# Altium schematic sheet 32原理图.SchDoc
size A2
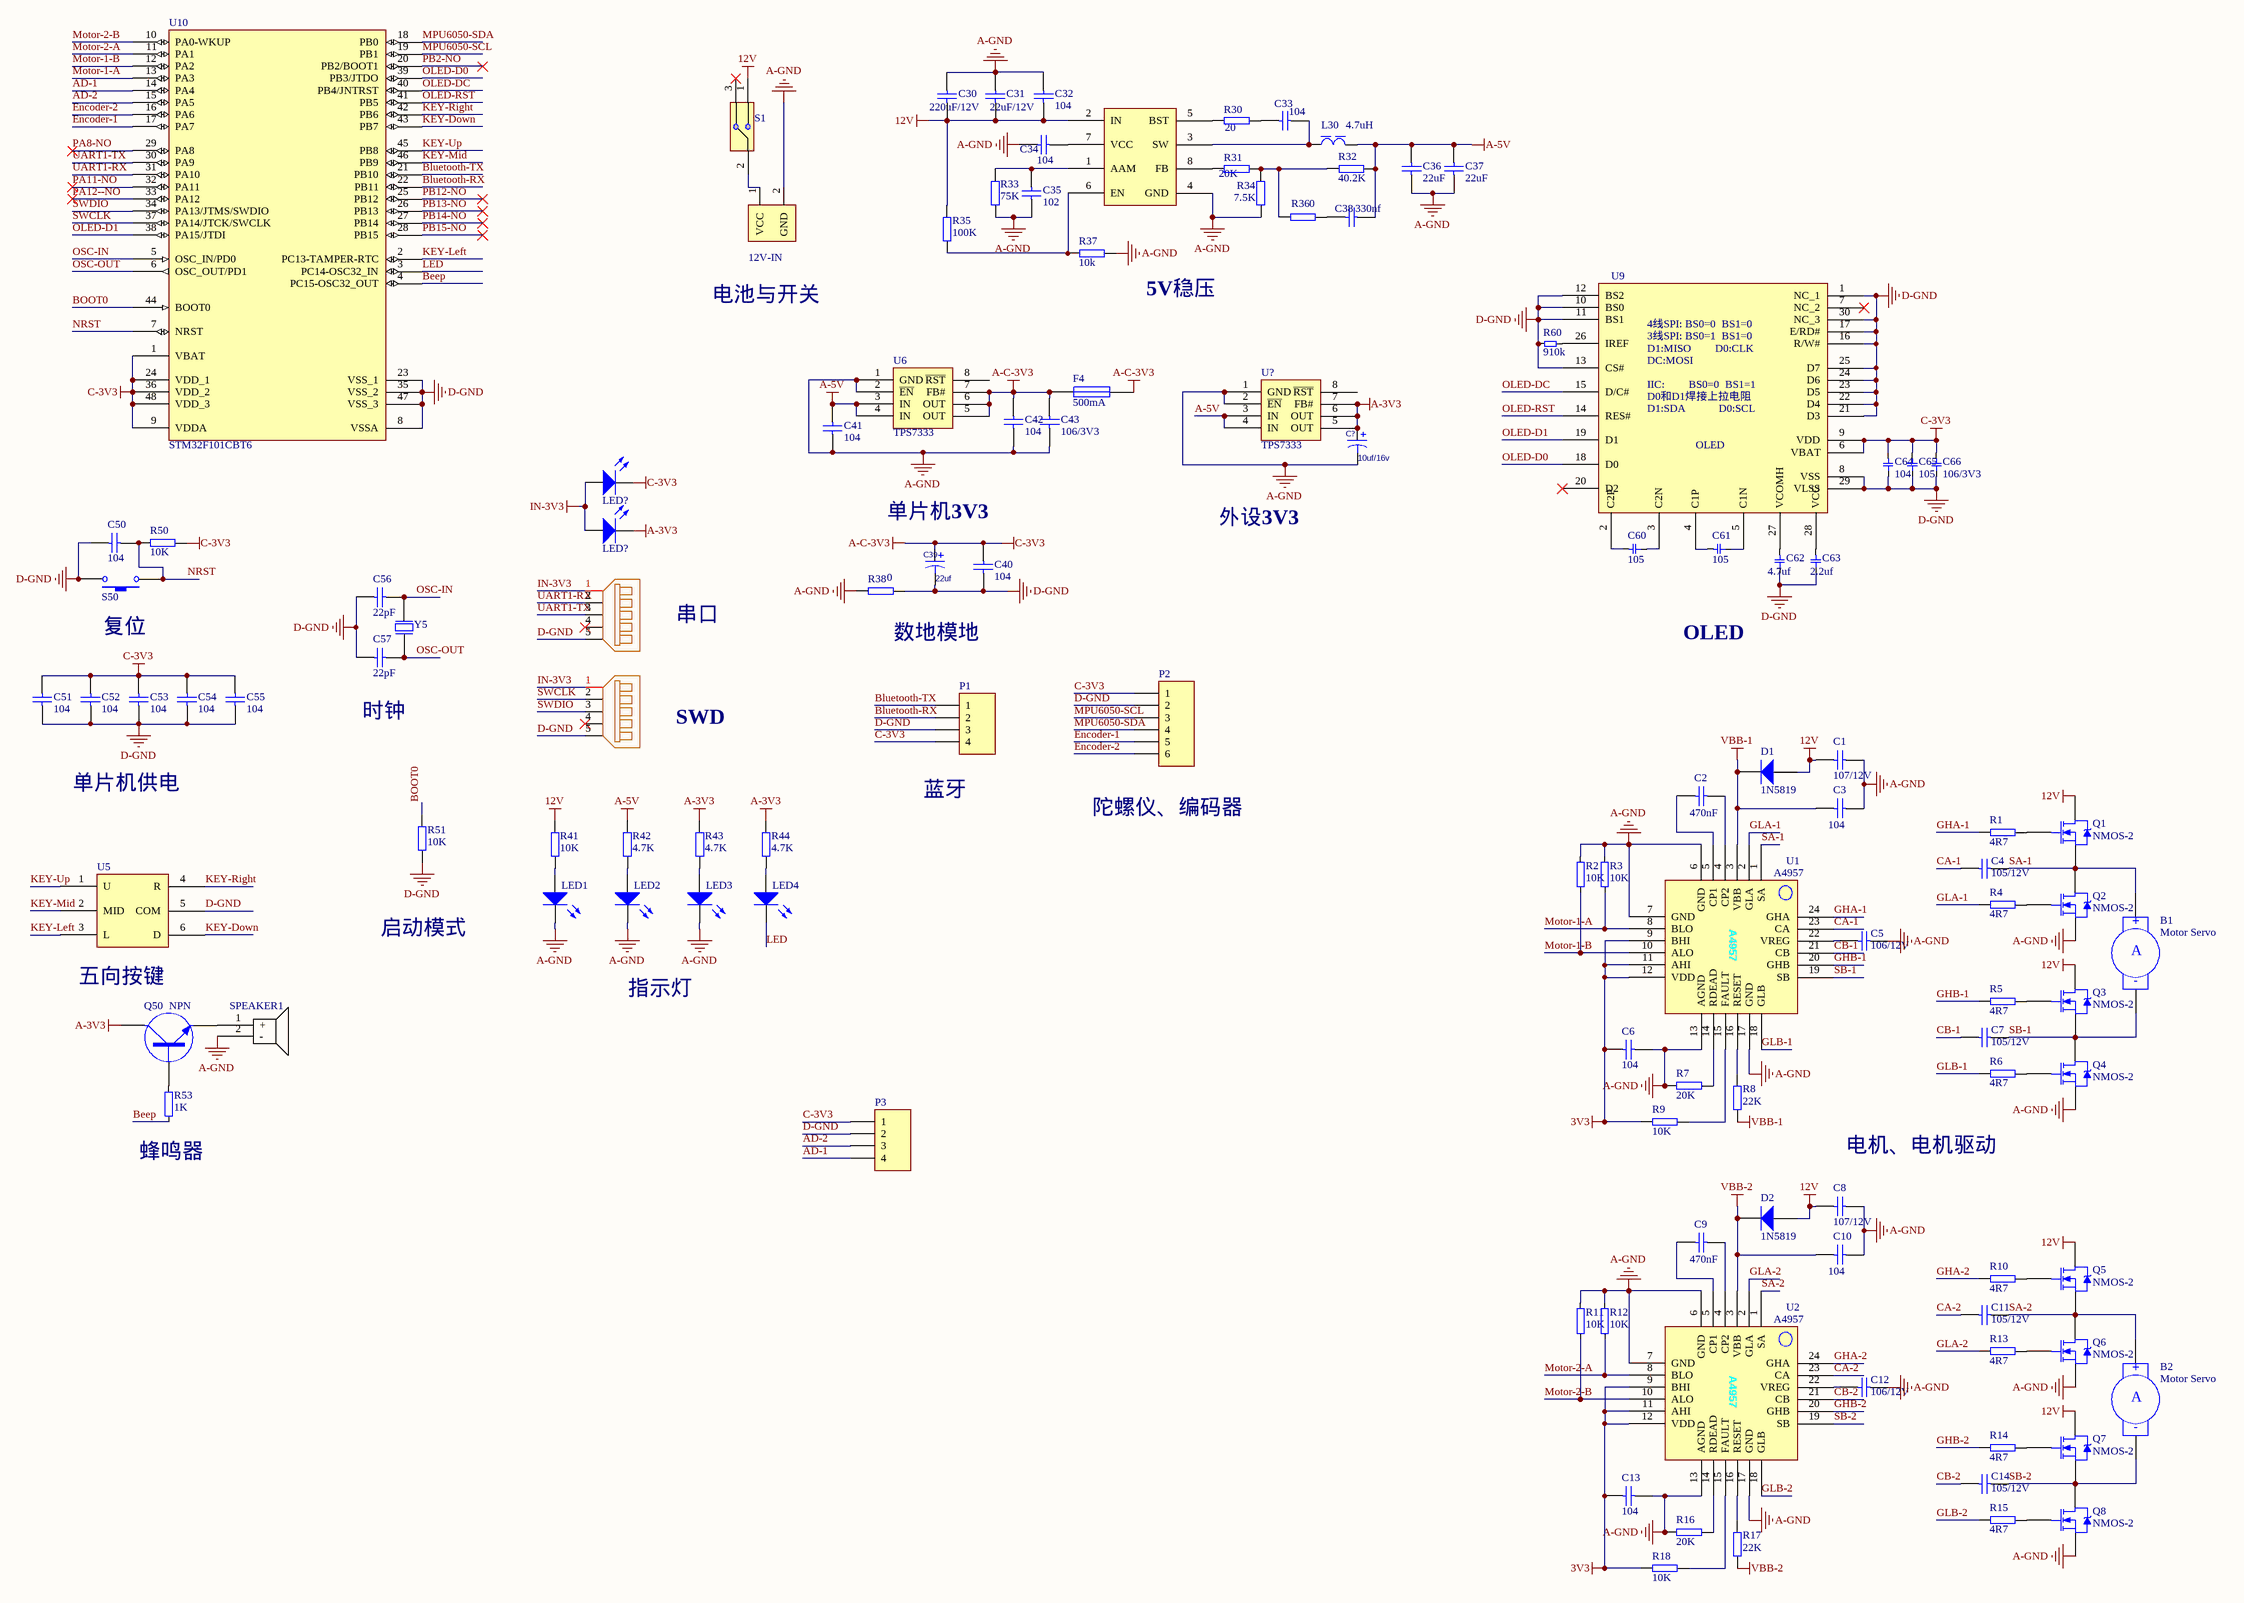
[diagram p0: 32原理图.SchDoc]

## Parts
(Parts that share a designator on the sheet are numbered #1, #2 ... from top to bottom, then left to right.)
12V-IN  Power12  [VBAT-2]  (value not drawn)
B1  Motor Servo  [电机接口 - duplicate]
B2  Motor Servo  [电机接口 - duplicate]
C1  107/12V  [CAPC4532[1812]]
C2  470nF  [CAPC1608[0603]]
C3  104  [CAPC1608[0603]]
C4  105/12V  [CAPC1608[0603]]
C5  106/12V  [CAPC2012[0805]]
C6  104  [CAPC1608[0603]]
C7  105/12V  [CAPC1608[0603]]
C8  107/12V  [CAPC4532[1812]]
C9  470nF  [CAPC1608[0603]]
C10  104  [CAPC1608[0603]]
C11  105/12V  [CAPC1608[0603]]
C12  106/12V  [CAPC2012[0805]]
C13  104  [CAPC1608[0603]]
C14  105/12V  [CAPC1608[0603]]
C30  220uF/12V  [CAPT7343]
C31  22uF/12V  [CAPC2012[0805]]
C32  104  [CAPC1608[0603]]
C33  104  [CAPC1608[0603]]
C34  104  [CAPC1608[0603]]
C35  102  [CAPC1608[0603]]
C36  22uF  [CAPC2012[0805]]
C37  22uF  [CAPC2012[0805]]
C38  330nf  [CAPC1608[0603]]
C39  value 22uf  [CAPT7343]  (hidden comment: Cap Pol2)
C40  104  [CAPC1608[0603]]
C41  104  [CAPC1608[0603]]
C42  104  [CAPC1608[0603]]
C43  106/3V3  [CAPC1608[0603]]
C50  104  [CAPC1608[0603]]
C51  104  [CAPC1608[0603]]
C52  104  [CAPC1608[0603]]
C53  104  [CAPC1608[0603]]
C54  104  [CAPC1608[0603]]
C55  104  [CAPC1608[0603]]
C56  22pF  [CAPC1608[0603]]
C57  22pF  [CAPC1608[0603]]
C60  105  [CAPC1608[0603]]
C61  105  [CAPC1608[0603]]
C62  4.7uf  [CAPC2012[0805]]
C63  2.2uf  [CAPC1608[0603]]
C64  104  [CAPC1608[0603]]
C65  105  [CAPC1608[0603]]
C66  106/3V3  [CAPC2012[0805]]
C?  value 10uf/16v  [钽电容3216]  (hidden comment: Cap Pol2)
D1  1N5819  [SMA[DO-214AC]]
D2  1N5819  [SMA[DO-214AC]]
F4  500mA  [CAPC2012[0805]]
L30  4.7uH  [CD52]
LED1  Red  [LED-0603]  (value not drawn)
LED2  Red  [LED-0603]  (value not drawn)
LED3  Red  [LED-0603]  (value not drawn)
LED4  Red  [LED-0603]  (value not drawn)
LED?#1  Red  [LED-0603]  (value not drawn)
LED?#2  Red  [LED-0603]  (value not drawn)
P1  蓝牙  [MK1.25_4P立]  (value not drawn)
P2  陀螺仪、编码器  [6P-卧头]  (value not drawn)
P3  蓝牙  [MK1.25_4P立]  (value not drawn)
Q1  NMOS-2  [IR7843-mg]
Q2  NMOS-2  [IR7843-mg]
Q3  NMOS-2  [IR7843-mg]
Q4  NMOS-2  [IR7843-mg]
Q5  NMOS-2  [IR7843-mg]
Q6  NMOS-2  [IR7843-mg]
Q7  NMOS-2  [IR7843-mg]
Q8  NMOS-2  [IR7843-mg]
Q50  NPN  [SOT23]
R1  4R7  [RESC1608[0603]]
R2  10K  [RESC1608[0603]]
R3  10K  [RESC1608[0603]]
R4  4R7  [RESC1608[0603]]
R5  4R7  [RESC1608[0603]]
R6  4R7  [RESC1608[0603]]
R7  20K  [RESC1608[0603]]
R8  22K  [RESC1608[0603]]
R9  10K  [RESC1608[0603]]
R10  4R7  [RESC1608[0603]]
R11  10K  [RESC1608[0603]]
R12  10K  [RESC1608[0603]]
R13  4R7  [RESC1608[0603]]
R14  4R7  [RESC1608[0603]]
R15  4R7  [RESC1608[0603]]
R16  20K  [RESC1608[0603]]
R17  22K  [RESC1608[0603]]
R18  10K  [RESC1608[0603]]
R30  20  [RESC1608[0603]]
R31  20K  [RESC1608[0603]]
R32  40.2K  [RESC1608[0603]]
R33  75K  [RESC1608[0603]]
R34  7.5K  [RESC1608[0603]]
R35  100K  [RESC1608[0603]]
R36  0  [RESC1608[0603]]
R37  10k  [RESC1608[0603]]
R38  0  [RESC1608[0603]]
R41  10K  [RESC1608[0603]]
R42  4.7K  [RESC1608[0603]]
R43  4.7K  [RESC1608[0603]]
R44  4.7K  [RESC1608[0603]]
R50  10K  [RESC1608[0603]]
R51  10K  [RESC1608[0603]]
R53  1K  [RESC1608[0603]]
R60  910k  [RESC1608[0603]]
S1  switch  [2(-1)脚3A开关-立]  (value not drawn)
S50  SW-PB  [key3*4*2]  (value not drawn)
SPEAKER1  有源蜂鸣器  [小Beep]  (value not drawn)
U1  A4957  [QFN-24]
U2  A4957  [QFN-24]
U5  五向按键  [5向key-小]  (value not drawn)
U6  TPS7333  [SOIC8]
U9  oled  [oled]  (value not drawn)
U10  STM32F101CBT6  [LQFP48_N]
U30  MP2315  [MP2315用SOP8]  (value not drawn)
U?  TPS7333  [SOIC8]
USB1  USB-5P  [Micro USB 牛角]  (value not drawn)
USB2  USB-5P  [Micro USB 牛角]  (value not drawn)
Y5  (no value)  [XTAL-PINGBI]

## Nets
3V3: C6.1 C13.1 R9.1 R18.1 U1.9(BHI) U1.11(AHI) U1.12(VDD) U2.9(BHI) U2.11(AHI) U2.12(VDD)
12V: C1.2 C8.2 C30.1 C31.1 C32.1 D1.A D2.A Q1.2(D) Q3.2(D) Q5.2(D) Q7.2(D) R35.2 R41.2 S1.1 U30.2(IN)
A-3V3: C?.1 LED?#2.2(C) Q50.3(E) R43.2 R44.2 U?.5(OUT) U?.6(OUT) U?.7(FB#)
A-5V: C36.2 C37.2 C38.1 C41.1 L30.2 R32.2 R42.2 U6.3(IN) U6.4(IN) U?.3(IN) U?.4(IN)
A-GND: 12V-IN.2(GND) C1.1 C3.1 C5.1 C6.2 C8.1 C10.1 C12.1 C13.2 C30.2 C31.2 C32.2 C34.2 C35.2 C36.1 C37.1 C41.2 C42.1 C43.1 C?.2 LED1.2(C) LED2.2(C) LED3.2(C) Q2.3(S) Q4.3(S) Q6.3(S) Q8.3(S) R2.2 R3.2 R7.2 R11.2 R12.2 R16.2 R33.1 R34.2 R37.1 R38.2 SPEAKER1.2(-) U1.6(GND) U1.7(GND) U1.13(AGND) U1.17(GND) U2.6(GND) U2.7(GND) U2.13(AGND) U2.17(GND) U6.1(GND) U6.2(~{EN}) U30.4(GND) U?.1(GND) U?.2(~{EN})
C-3V3: C39.1 C40.2 C42.2 C43.2 C51.2 C52.2 C53.2 C54.2 C55.2 C64.1 C65.1 C66.1 F4.1 F4.2 LED?#1.2(C) P1.4 P2.1 P3.1 R50.2 U6.5(OUT) U6.6(OUT) U6.7(FB#) U9.6(VBAT) U9.9(VDD) U10.1(VBAT) U10.9(VDDA) U10.24(VDD_1) U10.36(VDD_2) U10.48(VDD_3)  [also labelled A-C-3V3]
D-GND: C39.2 C40.1 C50.1 C51.1 C52.1 C53.1 C54.1 C55.1 C56.1 C57.1 C62.2 C63.2 C64.2 C65.2 C66.2 P1.3 P2.2 P3.2 R38.1 R51.1 R60.1 S50.1 U5.5(COM) U9.1(NC_1) U9.8(VSS) U9.10(BS0) U9.11(BS1) U9.12(BS2) U9.13(CS#) U9.16(R/W#) U9.17(E/RD#) U9.21(D3) U9.22(D4) U9.23(D5) U9.24(D6) U9.25(D7) U9.29(VLSS) U9.30(NC_3) U10.8(VSSA) U10.23(VSS_1) U10.35(VSS_2) U10.47(VSS_3) USB1.5(GND) USB2.5(GND)
IN-3V3: LED?#1.1(A) LED?#2.1(A) USB1.1(VBUS) USB2.1(VBUS)
VBB-1: C3.2 D1.K R8.2 U1.3(VBB)
VBB-2: C10.2 D2.K R17.2 U2.3(VBB)
AD-1: P3.4 U10.14(PA4)
AD-2: P3.3 U10.15(PA5)
Beep: R53.1 U10.4(PC15-OSC32_OUT)
Bluetooth-RX: P1.2 U10.22(PB11)
Bluetooth-TX: P1.1 U10.21(PB10)
BOOT0: R51.2 U10.44(BOOT0)
CA-1: C4.1 U1.23(CA)
CA-2: C11.1 U2.23(CA)
CB-1: C7.1 U1.21(CB)
CB-2: C14.1 U2.21(CB)
Encoder-1: P2.5 U10.17(PA7)
Encoder-2: P2.6 U10.16(PA6)
GHA-1: R1.2 U1.24(GHA)
GHA-2: R10.2 U2.24(GHA)
GHB-1: R5.2 U1.20(GHB)
GHB-2: R14.2 U2.20(GHB)
GLA-1: R4.1 U1.2(GLA)
GLA-2: R13.1 U2.2(GLA)
GLB-1: R6.1 U1.18(GLB)
GLB-2: R15.1 U2.18(GLB)
KEY-Down: U5.6(D) U10.43(PB7)
KEY-Left: U5.3(L) U10.2(PC13-TAMPER-RTC)
KEY-Mid: U5.2(MID) U10.46(PB9)
KEY-Right: U5.4(R) U10.42(PB6)
KEY-Up: U5.1(U) U10.45(PB8)
LED: LED4.2(C) U10.3(PC14-OSC32_IN)
Motor-1-A: R3.1 U1.8(BLO) U10.13(PA3)
Motor-1-B: R2.1 U1.10(ALO) U10.12(PA2)
Motor-2-A: R12.1 U2.8(BLO) U10.11(PA1)
Motor-2-B: R11.1 U2.10(ALO) U10.10(PA0-WKUP)
MPU6050-SCL: P2.3 U10.19(PB1)
MPU6050-SDA: P2.4 U10.18(PB0)
NRST: C50.2 R50.1 S50.2 U10.7(NRST)
OLED-D0: U9.18(D0) U10.39(PB3/JTDO)
OLED-D1: U9.19(D1) U10.38(PA15/JTDI)
OLED-DC: U9.15(D/C#) U10.40(PB4/JNTRST)
OLED-RST: U9.14(RES#) U10.41(PB5)
OSC-IN: C56.2 U10.5(OSC_IN/PD0) Y5.2(OSC2)
OSC-OUT: C57.2 U10.6(OSC_OUT/PD1) Y5.1(OSC1)
PA8-NO: U10.29(PA8)
PA11-NO: U10.32(PA11)
PA12--NO: U10.33(PA12)
PB2-NO: U10.20(PB2/BOOT1)
PB12-NO: U10.25(PB12)
PB13-NO: U10.26(PB13)
PB14-NO: U10.27(PB14)
PB15-NO: U10.28(PB15)
SA-1: B1.1(+) C4.2 Q1.3(S) Q2.2(D) U1.1(SA)
SA-2: B2.1(+) C11.2 Q5.3(S) Q6.2(D) U2.1(SA)
SB-1: B1.2(-) C7.2 Q3.3(S) Q4.2(D) U1.19(SB)
SB-2: B2.2(-) C14.2 Q7.3(S) Q8.2(D) U2.19(SB)
SWCLK: U10.37(PA14/JTCK/SWCLK) USB2.2(D-)
SWDIO: U10.34(PA13/JTMS/SWDIO) USB2.3(D+)
UART1-RX: U10.31(PA10) USB1.2(D-)
UART1-TX: U10.30(PA9) USB1.3(D+)
Net12V-IN_1: 12V-IN.1(VCC) S1.2
NetC2_1: C2.1 U1.4(CP2)
NetC2_2: C2.2 U1.5(CP1)
NetC5_2: C5.2 U1.22(VREG)
NetC9_1: C9.1 U2.4(CP2)
NetC9_2: C9.2 U2.5(CP1)
NetC12_2: C12.2 U2.22(VREG)
NetC33_1: C33.1 L30.1 U30.3(SW)
NetC33_2: C33.2 R30.1
NetC34_1: C34.1 U30.7(VCC)
NetC35_1: C35.1 R33.2 U30.1(AAM)
NetC38_2: C38.2 R36.2
NetC60_1: C60.1 U9.2(C2P)
NetC60_2: C60.2 U9.3(C2N)
NetC61_1: C61.1 U9.4(C1P)
NetC61_2: C61.2 U9.5(C1N)
NetC62_1: C62.1 U9.27(VCOMH)
NetC63_1: C63.1 U9.28(VCC)
NetLED1_1: LED1.1(A) R41.1
NetLED2_1: LED2.1(A) R42.1
NetLED3_1: LED3.1(A) R43.1
NetLED4_1: LED4.1(A) R44.1
NetQ1_1: Q1.1(G) R1.1
NetQ2_1: Q2.1(G) R4.2
NetQ3_1: Q3.1(G) R5.1
NetQ4_1: Q4.1(G) R6.2
NetQ5_1: Q5.1(G) R10.1
NetQ6_1: Q6.1(G) R13.2
NetQ7_1: Q7.1(G) R14.1
NetQ8_1: Q8.1(G) R15.2
NetQ50_1: Q50.1(B) SPEAKER1.1(+)
NetQ50_2: Q50.2(C) R53.2
NetR7_1: R7.1 U1.14(RDEAD)
NetR8_1: R8.1 U1.16(RESET)
NetR9_2: R9.2 U1.15(FAULT)
NetR16_1: R16.1 U2.14(RDEAD)
NetR17_1: R17.1 U2.16(RESET)
NetR18_2: R18.2 U2.15(FAULT)
NetR30_2: R30.2 U30.5(BST)
NetR31_1: R31.1 R32.1 R34.1 R36.1
NetR31_2: R31.2 U30.8(FB)
NetR35_1: R35.1 R37.2 U30.6(EN)
NetR60_2: R60.2 U9.26(IREF)

Not connected (* = marked no-connect by the designer): S1 3*; U6 8(~{RST}); U9 7(NC_2)* 20(D2)*; U? 8(~{RST}); USB1 4(ID)* 6(GND) 7(GND) 8(GND) 9(GND); USB2 4(ID)* 6(GND) 7(GND) 8(GND) 9(GND)

## Notes on the sheet
- 电池与开关
- 5V稳压
- (near U9) OLED
- 单片机3V3
- 外设3V3
- 复位
- 串口
- 数地模地
- OLED
- (near C57) 时钟
- SWD
- 单片机供电
- (near P1) 蓝牙
- (near P2) 陀螺仪、编码器
- 启动模式
- 五向按键
- 指示灯
- (near R53) 蜂鸣器
- 电机、电机驱动
- (in symbol Motor Servo) A
- (in symbol OLED_1306) 4线SPI: BS0=0  BS1=0; 3线SPI: BS0=1  BS1=0; D1:MISO        D0:CLK; DC:MOSI; IIC:        BS0=0  BS1=1; D0和D1焊接上拉电阻; D1:SDA           D0:SCL

## Library data of the parts
B1 B2 = Motor Servo: Servo Motor; Published: 24-Mar-1999; LatestRevisionDate: 17-Jul-2002; LatestRevisionNote: Re-released for DXP Platform.; PackageReference: RAD-0.4; Publisher: Altium Limited; PackageDescription: Radial Cap, Thru-Hole; 2 Leads; 0.4 in Pin Spacing
C1-C14 C41-C43 C50-C57 = Cap Chip 2: Chip Capacitor, Silkscreen Border; Voltage: 63V; Tolerance: Y5V; Published: 8-Jun-2000; Revision: July-2002: Re-released for DXP Platform.; Publisher: Altium Limited; Price(RMB): 0.000
  C1 C8: Value: 107/12V
  C2 C9: Value: 470nF
  C3 C6 C10 C13 C41 C42 C50-C55: Value: 104
  C4 C7 C11 C14: Value: 105/12V
  C5 C12: Value: 106/12V
  C43: Value: 106/3V3
  C56 C57: Value: 22pF
C30 = Cap Chip 1: Chip Capacitor, PSpice Model; Tolerance: Y5V; Published: 8-Jun-2000; Revision: July-2002: Re-released for DXP Platform.; Publisher: Altium Limited; Price(RMB): 0.000; Value: 220uF/12V
C31-C38 C40 = Cap Chip 1: Chip Capacitor, PSpice Model; Tolerance: Y5V; Voltage: 63V; Published: 8-Jun-2000; Revision: July-2002: Re-released for DXP Platform.; Publisher: Altium Limited; Price(RMB): 0.000
  C31: Value: 22uF/12V
  C32-C34 C40: Value: 104
  C35: Value: 102
  C36 C37: Value: 22uF
  C38: Value: 330nf
C39 C? = Cap Pol2: Polarized Capacitor (Axial); Published: 8-Jun-2000; LatestRevisionDate: 17-Jul-2002; LatestRevisionNote: Re-released for DXP Platform.; PackageReference: POLAR0.8; Publisher: Altium Limited; PackageDescription: Polarized Capacitor; 2 Leads
C60-C66 = ECAP
D1 D2 = Diode: Default Diode; Published: 8-Jun-2000; LatestRevisionDate: 17-Jul-2002; LatestRevisionNote: Re-released for DXP Platform.; PackageVersion: Sep-1996; PackageReference: SMC; Publisher: Altium Limited; PackageDescription: DO-214-AB/SMC; 2 C-Bend Leads; Body 7.9 x 5.9 mm, inc. leads (LxW); Code_JEDEC: DO-214-AB
F4 = Fuse chip: Fuse; Published: 8-Jun-2000; LatestRevisionDate: 17-Jul-2002; LatestRevisionNote: Re-released for DXP Platform.; PackageReference: PIN-W2/E2.8; Publisher: Altium Limited
L30 = Ind Power: Power Inductor, Ferrite-Core; Imax: 50mA; DCR: .5m; Published: 8-Jun-2000; Revision: July-2002: Re-released for DXP Platform.; Publisher: Altium Limited; Price(RMB): 0.000; Value: 4.7uH
LED1-LED4 LED?#1 LED?#2 = LED Chip: Typical Chip LED; Published: 8-Jun-2000; Revision: July-2002: Re-released for DXP Platform.; Publisher: Altium Limited; Price(RMB): 0.00; Color: Red
P1 P3 = Header 4: Header, 4-Pin; LatestRevisionDate: 17-Jul-2002; LatestRevisionNote: Re-released for DXP Platform.; Publisher: Altium Limited; Price(RMB): 0.00
P2 = Header 6: Header, 6-Pin; LatestRevisionDate: 17-Jul-2002; LatestRevisionNote: Re-released for DXP Platform.; Publisher: Altium Limited; Price(RMB): 0.00
Q1-Q8 = NMOS-2: N-Channel Power MOSFET; Note: Pin 2 is electrically connected to pin 4.; Published: 8-Jun-2000; LatestRevisionDate: 17-Jul-2002; LatestRevisionNote: Re-released for DXP Platform.; DatasheetVersion: PD-9.814; PackageVersion: Feb-1997; PackageReference: TO-220AB; Publisher: Altium Limited; PackageDescription: TO, Thru-Hole, Vertical, Heatsink Mounted; 3 In-Line Leads; Pitch 2.54 mm; ComponentLink1Description: Manufacturer Link; ComponentLink1URL: http://www.irf.com/
Q50 = NPN: NPN Transistor
R1 R4-R10 R13-R18 = Res Chip 2p 2: Chip Resistor, Border Silkscreen On PCB Library; Tolerance: 5%; Published: 8-Jun-2000; Revision: July-2002: Re-released for DXP Platform.; Publisher: Altium Limited; Price(RMB): 0.000
  R1 R4-R6 R10 R13-R15: Value: 4R7
  R7 R16: Value: 20K
  R8 R17: Value: 22K
  R9 R18: Value: 10K
R2 R3 R11 R12 = R-10K: resistor
R30-R35 R37 R41-R44 R50 R51 = Res Chip 2p 1: Chip Resistor, PSpice Model, IPC PCB Library Drawing; Tolerance: 5%; TC1: 0; Published: 8-Jun-2000; Revision: July-2002: Re-released for DXP Platform.; Publisher: Altium Limited; Price(RMB): 0.000; TC2: 0
  R30: Value: 20
  R31: Value: 20K
  R32: Value: 40.2K
  R33: Value: 75K
  R34: Value: 7.5K
  R35: Value: 100K
  R37: Value: 10k
  R41 R50 R51: Value: 10K
  R42-R44: Value: 4.7K
R36 R38 = Res Chip 2p 1: Chip Resistor, PSpice Model, IPC PCB Library Drawing; Tolerance: 5%; Published: 8-Jun-2000; Revision: July-2002: Re-released for DXP Platform.; Publisher: Altium Limited; Price(RMB): 0.000; TC1: 0; TC2: 0; Value: 0
R53 = RES
R60 = 1K: CR85-102J
S50 = SW-PB: Switch; Published: 24-Mar-1999; Revision: July-2002: Re-released for DXP Platform.; Publisher: Altium Limited; Price(RMB): 0.000
U1 U2 = A4957: A4957SESTR-T
U6 U? = TPS73xx
U9 = OLED_1306
U10 = STM32F101CBT6: STM32 ARM-based 32-bit MCU with 128 Kbytes Flash, 48-pin LQFP, Industrial Temperature; Published: 30-May-2008; DatasheetVersion: rev6, Mar-2008; PackageVersion: Mar-2008; PackageReference: LQFP48; Publisher: Altium Limited; PackageDescription: 48-Pin Low-Profile Quad Flat Pack, 7 x 7 mm Body, 0.5 mm Pitch (LQFP48); ComponentLink1Description: Manufacturer Link; ComponentLink1URL: www.st.com/stm32; ComponentLink2Description: Datasheet; ComponentLink2URL: http://www.st.com/stonline/products/literature/ds/13586.pdf
USB1 USB2 = USB-5P: USB CONNECTOR; Price(RMB): 0.00
Y5 = XTAL: Crystal Oscillator; Value: 8MHz; Published: 8-Jun-2000; Revision: July-2002: Re-released for DXP Platform.; Publisher: Altium Limited; Price(RMB): 0.000